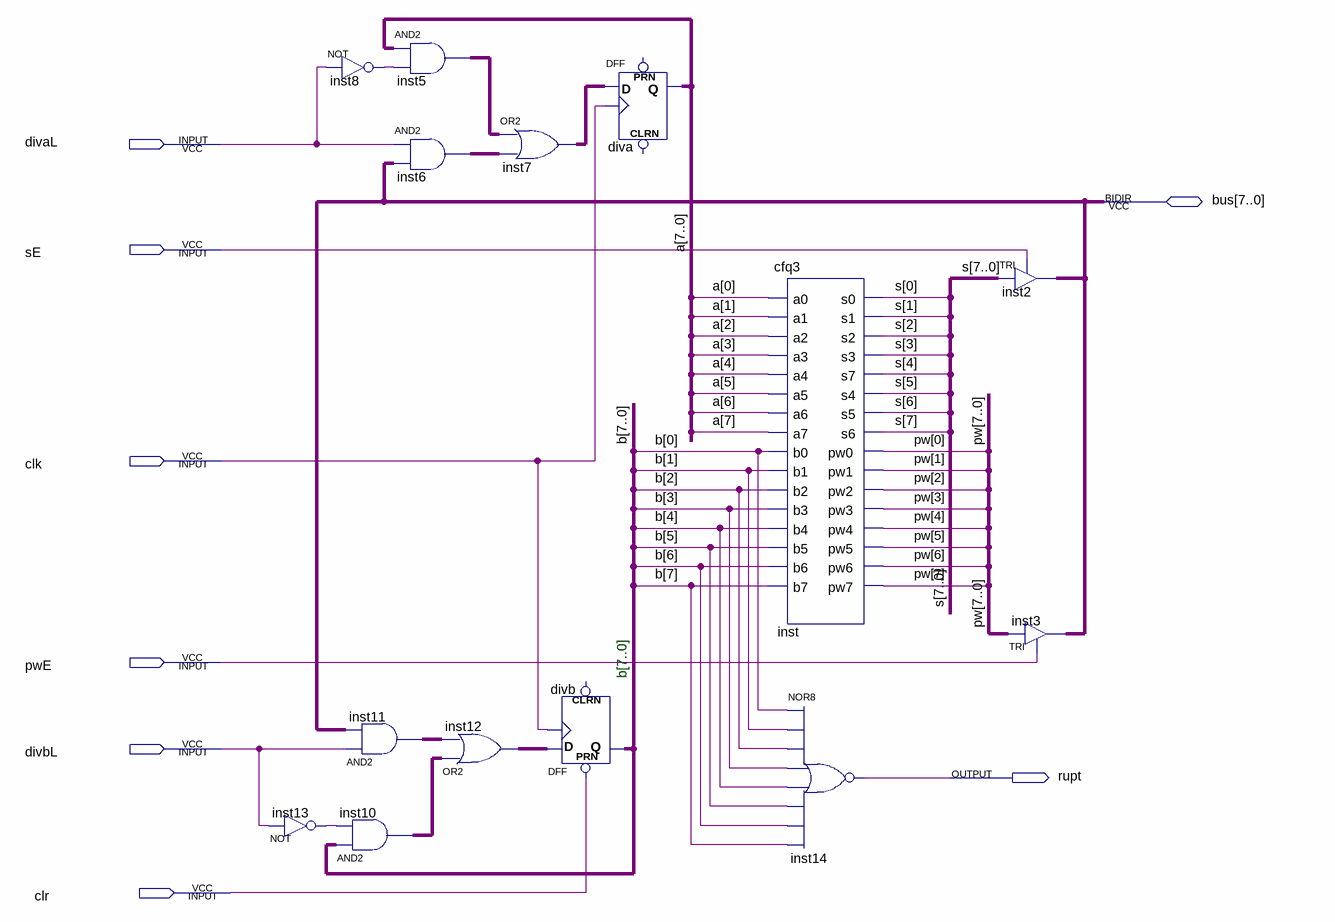
[diagram p0: schematic sheet]
// Quartus schematic cfq.bdf as structural Verilog: 14 symbols, 8 pins
module cfq (
  input  divaL,
  input  sE,
  input  clk,
  input  pwE,
  input  divbL,
  input  clr,
  inout  [7:0] bus,
  output rupt
);

  wire inst8_out, inst13_out;
  wire [7:0] a, b, inst5_out, inst6_out, inst7_out, inst10_out, inst11_out, inst12_out, pw, s;

  not inst8 (inst8_out, divaL);
  assign inst10_out = b & {8{inst13_out}};  // AND2 inst10, 8 bits wide
  not inst13 (inst13_out, divbL);
  assign inst5_out = a & {8{inst8_out}};  // AND2 inst5, 8 bits wide
  assign inst6_out = {8{divaL}} & bus;  // AND2 inst6, 8 bits wide
  assign inst11_out = {8{divbL}} & bus;  // AND2 inst11, 8 bits wide
  assign inst12_out = inst10_out | inst11_out;  // OR2 inst12, 8 bits wide
  assign inst7_out = inst5_out | inst6_out;  // OR2 inst7, 8 bits wide
  DFF divb[7:0] (.CLK(clk), .D(inst12_out), .PRN(clr), .Q(b));  // open: CLRN
  DFF diva[7:0] (.CLK(clk), .D(inst7_out), .Q(a));  // open: CLRN, PRN
  cfq3 inst (
    .a0(a[0]), .a1(a[1]), .a2(a[2]), .a3(a[3]), .a4(a[4]), .a5(a[5]), .a6(a[6]), .a7(a[7]), .b0(b[0]),
    .b1(b[1]), .b2(b[2]), .b3(b[3]), .b4(b[4]), .b5(b[5]), .b6(b[6]), .b7(b[7]), .s0(s[0]), .s1(s[1]),
    .s2(s[2]), .s3(s[3]), .s7(s[4]), .s4(s[5]), .s5(s[6]), .s6(s[7]), .pw0(pw[0]), .pw1(pw[1]), .pw2(pw[2]),
    .pw3(pw[3]), .pw4(pw[4]), .pw5(pw[5]), .pw6(pw[6]), .pw7(pw[7]));
  nor inst14 (rupt, b[0], b[1], b[2], b[3], b[4], b[5], b[6], b[7]);
  TRI inst2[7:0] (.IN(s), .OE(sE), .OUT(bus));
  TRI inst3[7:0] (.IN(pw), .OE(pwE), .OUT(bus));

  // Notes on the sheet:
  //   b[7..0]
endmodule
